# Altium project luz.PrjPcb
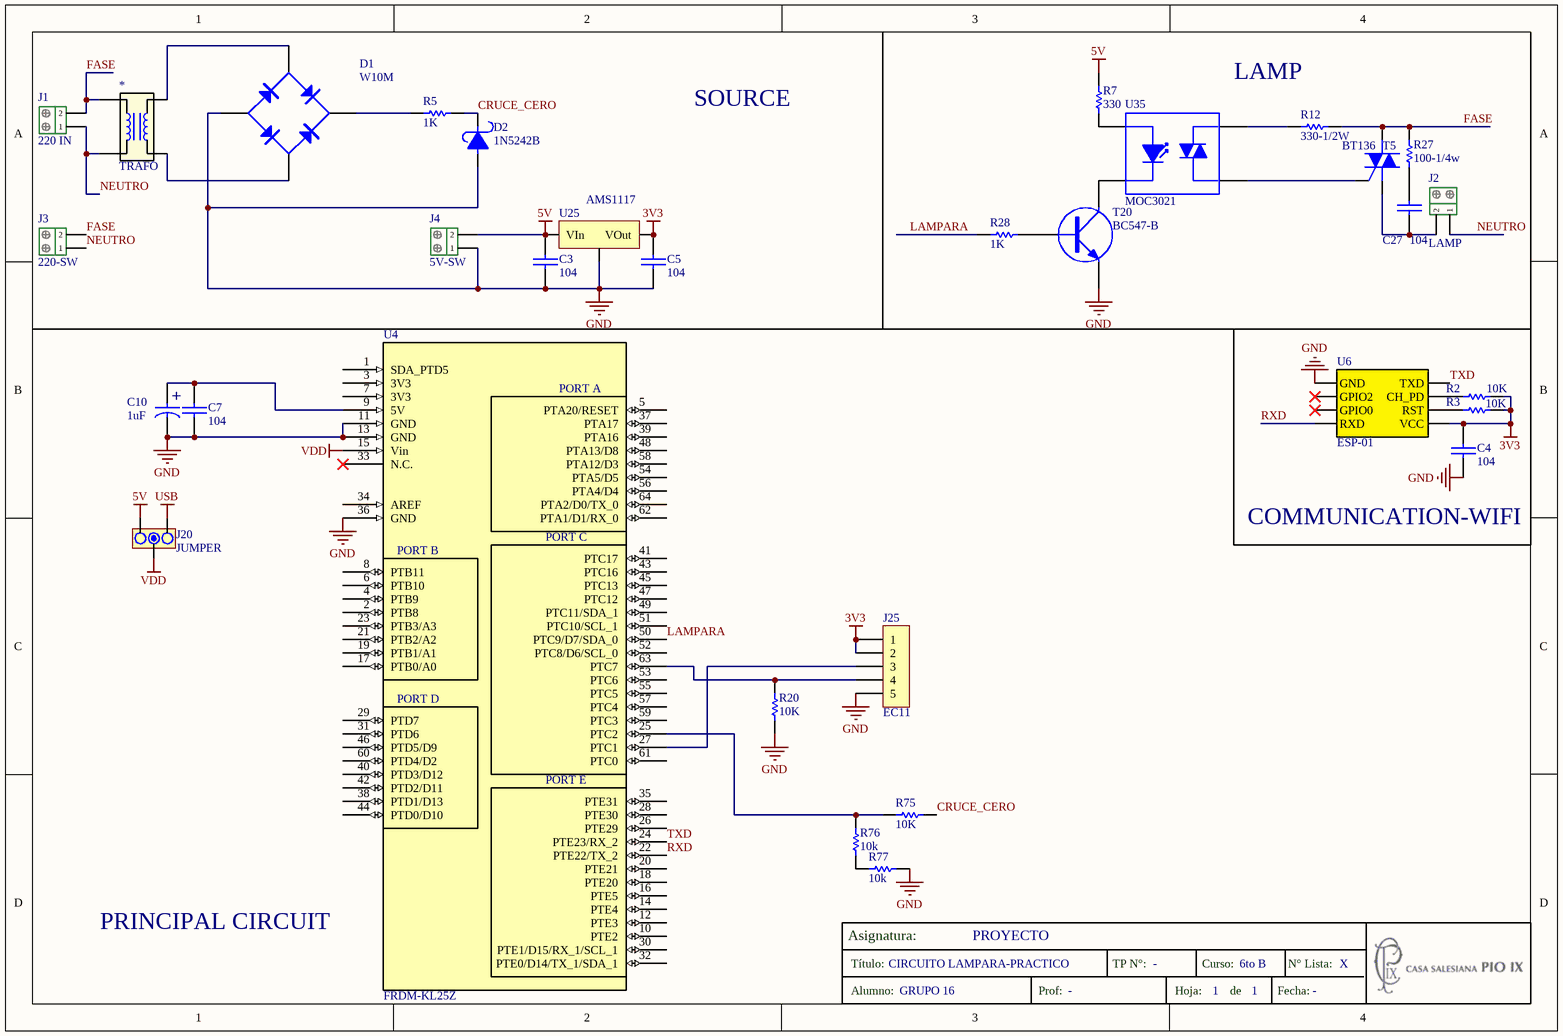
[diagram p0: esq.SchDoc]
1 sheet, 32 parts. Net scope: global (net labels, ports and power ports of the same name join across sheets).
Board files: PCB1.PcbDoc, PANEL.PcbDoc

## Sheet esq.SchDoc
size A4; SheetNumber: 1; SheetTotal: 1; Titulo: CIRCUITO LAMPARA-PRACTICO; Alumno: GRUPO 16; profesor: -; curso: 6to B; TPN: -; NLista: X; Asignatura: PROYECTO; Año: 2020; ModifiedDate: -; Rule: PcbType=ProtelPcb

### Parts
*  TRAFO  [trafo]
C3  104  [0805]
C4  104  [0805]
C5  104  [0805]
C7  104  [0805]
C10  1uF  [CAP100RP]
C27  104  [0805]
D1  W10M  [PUENTE - W10M]
D2  1N5242B  [Diodo]
J1  220 IN  [BORNERA2]
J2  LAMP  [BORNERA2]
J3  220-SW  [BORNERA2]
J4  5V-SW  [BORNERA2]
J20  JUMPER  [JUMPER3]
J25  EC11  [BORNERA5]
R2  10K  [0805]
R3  10K  [0805]
R5  1K  [0805]
R7  330  [0805]
R12  330-1/2W  [RES500]
R20  10K  [0805]
R27  100-1/4w  [RES400]
R28  1K  [0805]
R75  10K  [0805]
R76  10k  [0805]
R77  10k  [0805]
T5  BT136  [BT136]
T20  BC547-B  [SOT23]
U4  FRDM-KL25Z  [MICRO]
U6  ESP-01  [ESP-01]
U25  AMS1117  [AMS1117]
U35  MOC3021  [MOC3021]

### Nets
3V3: C4.2 C5.1 J25.1 J25.2 R2.1 R3.1 U6.8(VCC) U25.3(VOut)
5V: C3.1 J4.2 J20.1 R7.1 U25.1(VIn)
GND: C3.2 C4.1 C5.2 C7.1 C10.2 D1.3(V-) D2.1 J4.1 J25.5 R20.1 R77.1 T20.3(E) U4.11(GND) U4.13(GND) U4.36(GND) U6.1(GND) U25.2(GND)
USB: J20.3
VDD: J20.2 U4.15(Vin)
CRUCE_CERO: D2.2 R5.2 R75.1
FASE: *.1 J1.2 J3.2 R12.2 R27.2 T5.2(M2)
LAMPARA: R28.1 U4.50(PTC9/D7/SDA_0)
NEUTRO: *.5 J1.1 J2.1 J3.1
RXD: U4.22(PTE22/TX_2) U6.4(RXD)
TXD: U4.24(PTE23/RX_2) U6.5(TXD)
Net*_7: *.7 D1.2(AC)
Net*_9: *.9 D1.4(AC)
NetC7_2: C7.2 C10.1 U4.9(5V)
NetC27_1: C27.1 R27.1
NetC27_2: C27.2 J2.2 T5.1(M1)
NetD1_1: D1.1(V+) R5.1
NetJ25_3: J25.3 U4.27(PTC1)
NetJ25_4: J25.4 R20.2 U4.63(PTC7)
NetR2_2: R2.2 U6.6(CH_PD)
NetR3_2: R3.2 U6.7(RST)
NetR7_2: R7.2 U35.1(A)
NetR12_1: R12.1 U35.6(C)
NetR28_2: R28.2 T20.1(B)
NetR75_2: R75.2 R76.2 U4.25(PTC2)
NetR76_1: R76.1 R77.2
NetT5_3: T5.3(G) U35.4(E)
NetT20_2: T20.2(C) U35.2(K)

Not connected (* = marked no-connect by the designer): U4 1(SDA_PTD5) 2(PTB8) 3(3V3) 4(PTB9) 5(PTA20/RESET) 6(PTB10) 7(3V3) 8(PTB11) 10(PTE2) 12(PTE3) 14(PTE4) 16(PTE5) 17(PTB0/A0) 18(PTE20) 19(PTB1/A1) 20(PTE21) 21(PTB2/A2) 23(PTB3/A3) 26(PTE29) 28(PTE30) 29(PTD7) 30(PTE1/D15/RX_1/SCL_1) 31(PTD6) 32(PTE0/D14/TX_1/SDA_1) 33(N.C.)* 34(AREF) 35(PTE31) 37(PTA17) 38(PTD1/D13) 39(PTA16) 40(PTD3/D12) 41(PTC17) 42(PTD2/D11) 43(PTC16) 44(PTD0/D10) 45(PTC13) 46(PTD5/D9) 47(PTC12) 48(PTA13/D8) 49(PTC11/SDA_1) 51(PTC10/SCL_1) 52(PTC8/D6/SCL_0) 53(PTC6) 54(PTA5/D5) 55(PTC5) 56(PTA4/D4) 57(PTC4) 58(PTA12/D3) 59(PTC3) 60(PTD4/D2) 61(PTC0) 62(PTA1/D1/RX_0) 64(PTA2/D0/TX_0); U6 2(GPIO2)* 3(GPIO0)*

### Notes on the sheet
- SOURCE
- LAMP
- (near C4) COMMUNICATION-WIFI
- PRINCIPAL CIRCUIT
- Asignatura:
- Título:
- TP N°:
- Curso:
- N° Lista:
- Alumno:
- Prof:
- Hoja:
- de
- Fecha:
- (in symbol CAPPOL) +
- (in symbol FRDM-KL25Z) PORT A; PORT C; PORT B; PORT D; PORT E
- (in symbol MC9S08SH8) PORT B; PORT A; PORT C

### Library data of the parts
C3-C5 C7 C27 = CAP: Autor: Guido Spataro; Data: Libebal; Fecha: 07/04/19
C10 = CAPPOL: Cap polarizado
D1 = PUENTE
D2 = DIODO SCHOTTKY: Diodo; Autor: Guido Spataro; DAta: https://assets.nexperia.com/documents/outline-drawing/SOD123.pdf; Fecha: 07/04/19
J1-J4 = Bornera_2: Bornera de 2 pines; Autor: Guido Spataro; Datasheet: Libebal; Fecha: 07/04/19
J20 = JUMPER3
J25 = BORNERA 5
R2 R3 R5 R7 R12 R20 R27 R28 R75-R77 = RES: Resistencia; Autor: Guido Spataro; Data: Libebal; Fecha: 07/04/19
T20 = TRANSISTOR NPN
U4 = FRDM-KL25Z: Autor: Guido Spataro; data: https://www.nxp.com/docs/en/data-sheet/MC9S08SH8.pdf; Fecha: 07/04/19
U35 = MOC3021: OPTO-ACOPLADOR